# Altium schematic sheet HT66F0185_NightLED_V4.0.SchDoc
size A3
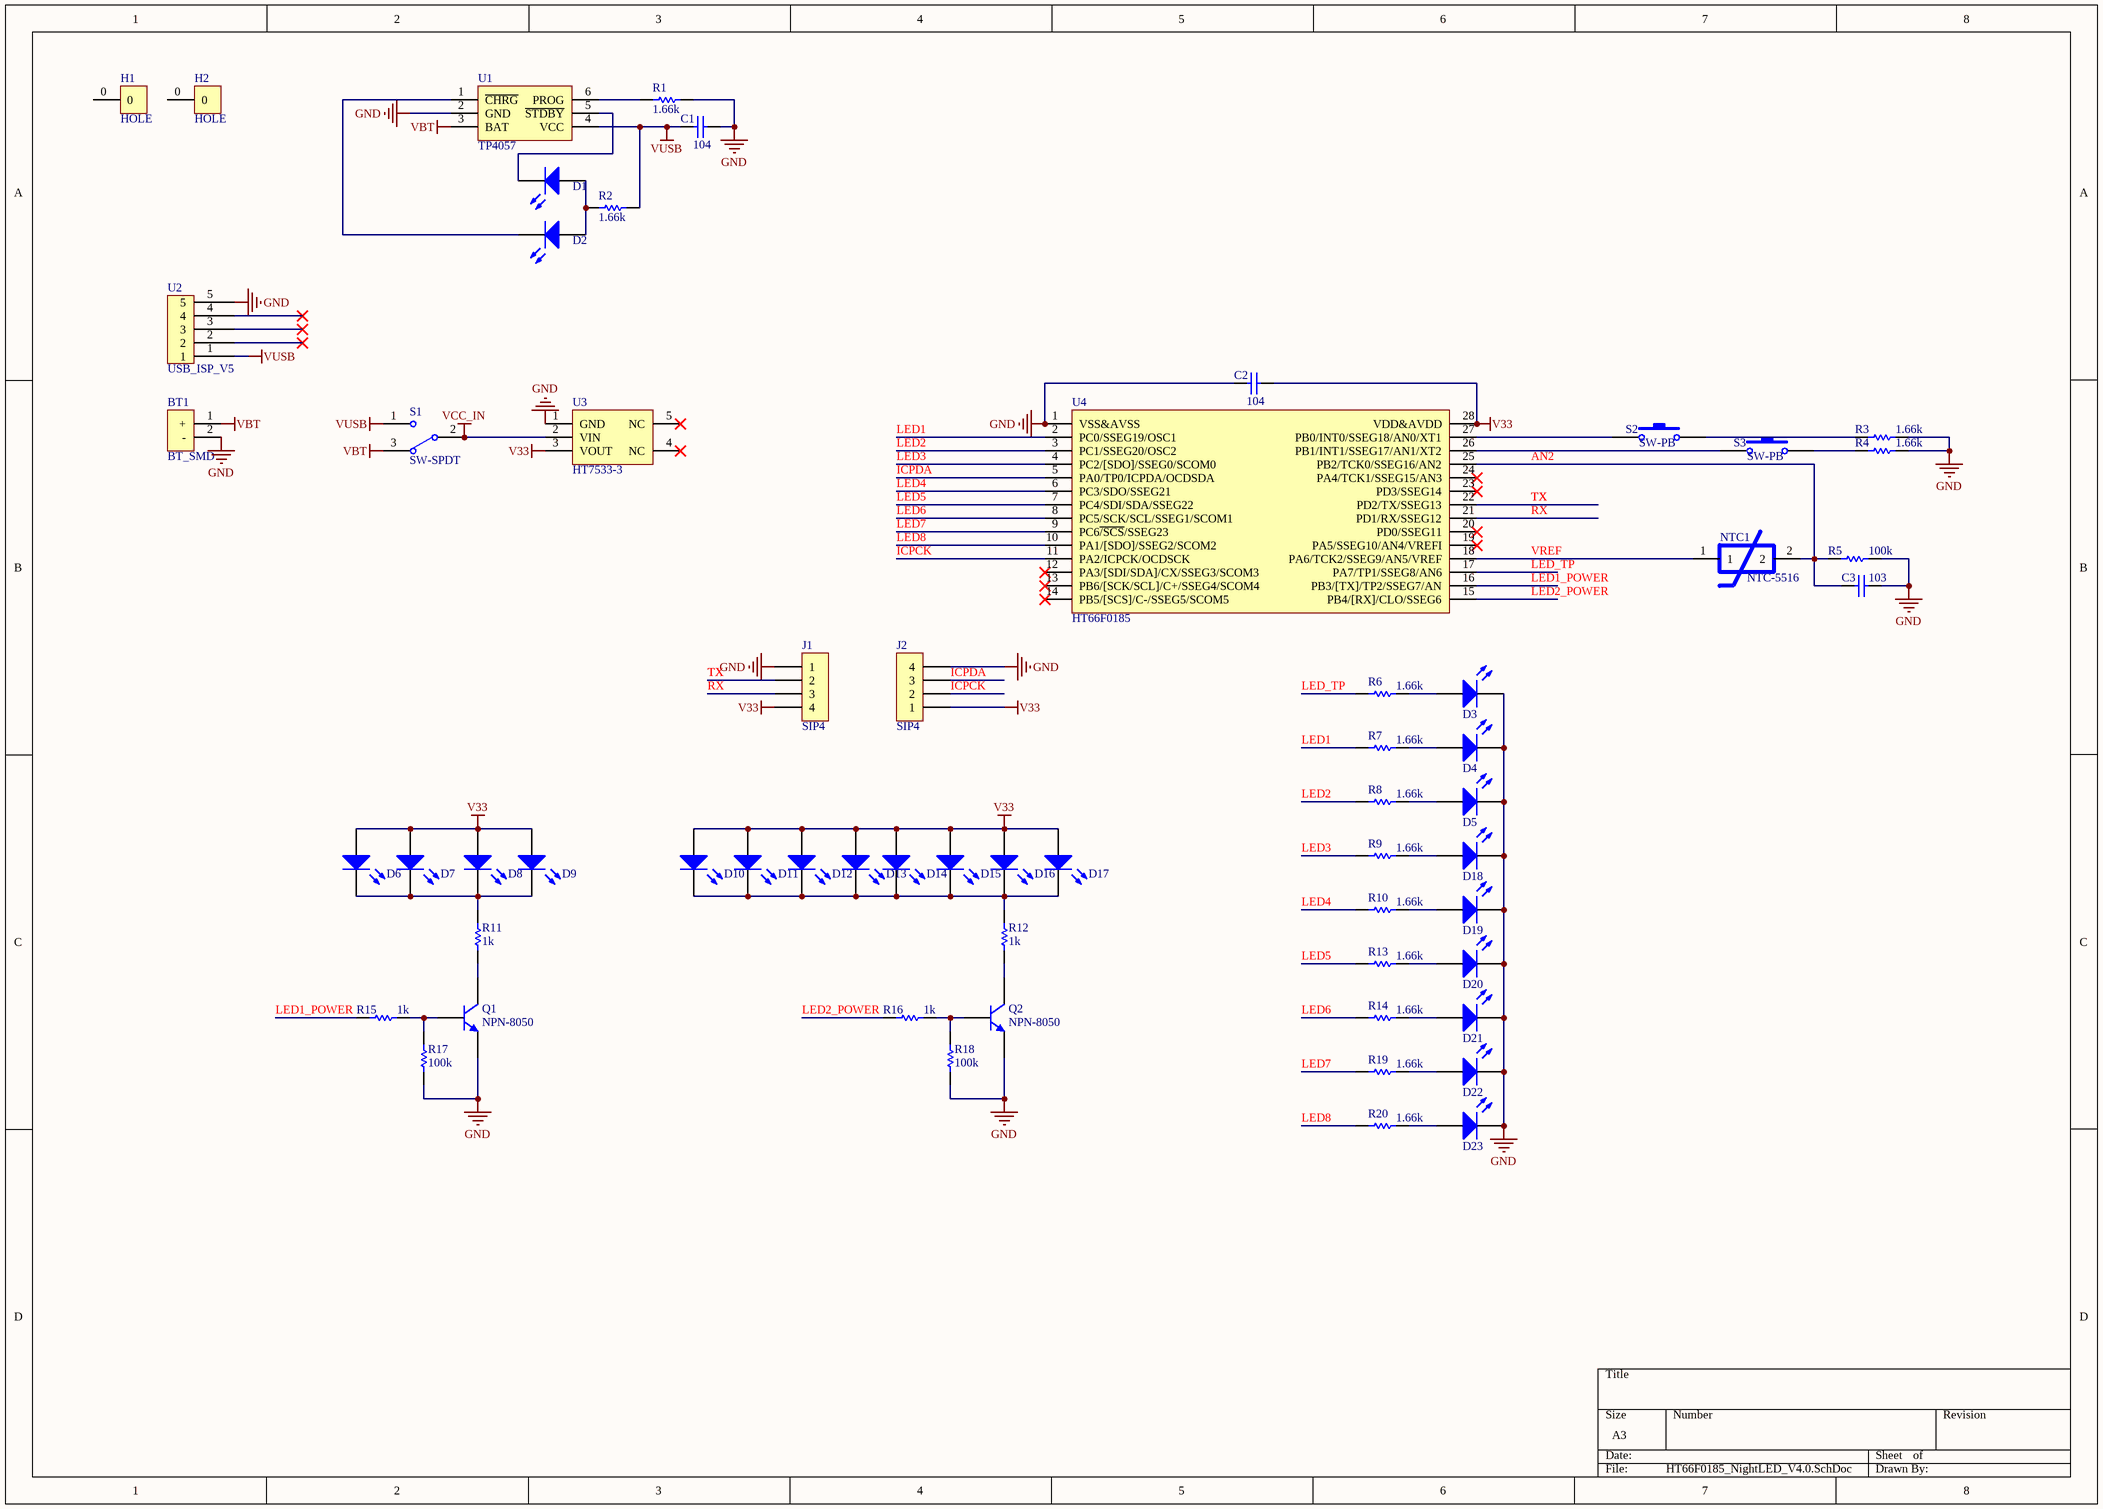
[diagram p0: HT66F0185_NightLED_V4.0.SchDoc]

## Parts
BT1  BT_SMD  [PIN_2]
C1  value 104  [C_0603]  (hidden comment: Cap)
C2  value 104  [C_0603]  (hidden comment: Cap)
C3  value 103  [C_0603]  (hidden comment: Cap)
D1  LED0  [LED_0805(Y)]  (value not drawn)
D2  LED0  [LED_0805(Y)]  (value not drawn)
D3  LED0  [LED_0805(Y)]  (value not drawn)
D4  LED0  [LED_0805(Y)]  (value not drawn)
D5  LED0  [LED_0805(Y)]  (value not drawn)
D6  LED0  [LED_0805(Y)]  (value not drawn)
D7  LED0  [LED_0805(Y)]  (value not drawn)
D8  LED0  [LED_0805(Y)]  (value not drawn)
D9  LED0  [LED_0805(Y)]  (value not drawn)
D10  LED0  [LED_0805(Y)]  (value not drawn)
D11  LED0  [LED_0805(Y)]  (value not drawn)
D12  LED0  [LED_0805(Y)]  (value not drawn)
D13  LED0  [LED_0805(Y)]  (value not drawn)
D14  LED0  [LED_0805(Y)]  (value not drawn)
D15  LED0  [LED_0805(Y)]  (value not drawn)
D16  LED0  [LED_0805(Y)]  (value not drawn)
D17  LED0  [LED_0805(Y)]  (value not drawn)
D18  LED0  [LED_0805(Y)]  (value not drawn)
D19  LED0  [LED_0805(Y)]  (value not drawn)
D20  LED0  [LED_0805(Y)]  (value not drawn)
D21  LED0  [LED_0805(Y)]  (value not drawn)
D22  LED0  [LED_0805(Y)]  (value not drawn)
D23  LED0  [LED_0805(Y)]  (value not drawn)
H1  HOLE  [Screw Hole_NightLED_V4.0]
H2  HOLE  [Screw Hole_NightLED_V4.0]
J1  SIP4  [PIN_4(SMD) - duplicate]
J2  SIP4  [PIN_4(SMD) - duplicate]
NTC1  NTC-5516  [PIN_2]
Q1  NPN-8050  [SOT_23_3]
Q2  NPN-8050  [SOT_23_3]
R1  value 1.66k  [R_0603]  (hidden comment: Res1)
R2  value 1.66k  [R_0603]  (hidden comment: Res1)
R3  value 1.66k  [R_0603]  (hidden comment: Res1)
R4  value 1.66k  [R_0603]  (hidden comment: Res1)
R5  value 100k  [R_0603]  (hidden comment: Res1)
R6  value 1.66k  [R_0603]  (hidden comment: Res1)
R7  value 1.66k  [R_0603]  (hidden comment: Res1)
R8  value 1.66k  [R_0603]  (hidden comment: Res1)
R9  value 1.66k  [R_0603]  (hidden comment: Res1)
R10  value 1.66k  [R_0603]  (hidden comment: Res1)
R11  value 1k  [R_0603]  (hidden comment: Res1)
R12  value 1k  [R_0603]  (hidden comment: Res1)
R13  value 1.66k  [R_0603]  (hidden comment: Res1)
R14  value 1.66k  [R_0603]  (hidden comment: Res1)
R15  value 1k  [R_0603]  (hidden comment: Res1)
R16  value 1k  [R_0603]  (hidden comment: Res1)
R17  value 100k  [R_0603]  (hidden comment: Res1)
R18  value 100k  [R_0603]  (hidden comment: Res1)
R19  value 1.66k  [R_0603]  (hidden comment: Res1)
R20  value 1.66k  [R_0603]  (hidden comment: Res1)
S1  SW-SPDT  [SW-SPDT]
S2  SW-PB  [micro button_4_SMD]
S3  SW-PB  [micro button_2_SMD]
U1  TP4057  [SOT_23_6]
U2  USB_ISP_V5  [MicroUSB]
U3  HT7533-3  [SOT_23_5]
U4  HT66F0185  [SSOP_28]

## Nets
GND: BT1.2(-) C1.1 C2.2 C3.1 D3.2(K) D4.2(K) D5.2(K) D18.2(K) D19.2(K) D20.2(K) D21.2(K) D22.2(K) D23.2(K) J1.1 J2.4 Q1.3(E) Q2.3(E) R1.1 R3.1 R4.1 R5.1 R17.2 R18.2 U1.2(GND) U2.5 U3.1(GND) U4.1(VSS&AVSS)
V33: C2.1 D6.1(A) D7.1(A) D8.1(A) D9.1(A) D10.1(A) D11.1(A) D12.1(A) D13.1(A) D14.1(A) D15.1(A) D16.1(A) D17.1(A) J1.4 J2.1 U3.3(VOUT) U4.28(VDD&AVDD)
VBT: BT1.1(+) S1.3 U1.3(BAT)
VCC_IN: S1.2 U3.2(VIN)
VUSB: C1.2 R2.1 S1.1 U1.4(VCC) U2.1
AN2: C3.2 NTC1.2 R5.2 U4.25(PB2/TCK0/SSEG16/AN2)
ICPCK: J2.2 U4.11(PA2/ICPCK/OCDSCK)
ICPDA: J2.3 U4.5(PA0/TP0/ICPDA/OCDSDA)
LED1: R7.2 U4.2(PC0/SSEG19/OSC1)
LED1_POWER: R15.2 U4.16(PB3/[TX]/TP2/SSEG7/AN)
LED2: R8.2 U4.3(PC1/SSEG20/OSC2)
LED2_POWER: R16.2 U4.15(PB4/[RX]/CLO/SSEG6)
LED3: R9.2 U4.4(PC2/[SDO]/SSEG0/SCOM0)
LED4: R10.2 U4.6(PC3/SDO/SSEG21)
LED5: R13.2 U4.7(PC4/SDI/SDA/SSEG22)
LED6: R14.2 U4.8(PC5/SCK/SCL/SSEG1/SCOM1)
LED7: R19.2 U4.9(PC6~{/SCS}/SSEG23)
LED8: R20.2 U4.10(PA1/[SDO]/SSEG2/SCOM2)
LED_TP: R6.2 U4.17(PA7/TP1/SSEG8/AN6)
RX: J1.3 U4.21(PD1/RX/SSEG12)
TX: J1.2 U4.22(PD2/TX/SSEG13)
VREF: NTC1.1 U4.18(PA6/TCK2/SSEG9/AN5/VREF)
NetD1_1: D1.1(A) D2.1(A) R2.2
NetD1_2: D1.2(K) U1.5(~{STDBY})
NetD2_2: D2.2(K) U1.1(~{CHRG})
NetD3_1: D3.1(A) R6.1
NetD4_1: D4.1(A) R7.1
NetD5_1: D5.1(A) R8.1
NetD6_2: D6.2(K) D7.2(K) D8.2(K) D9.2(K) R11.1
NetD10_2: D10.2(K) D11.2(K) D12.2(K) D13.2(K) D14.2(K) D15.2(K) D16.2(K) D17.2(K) R12.1
NetD18_1: D18.1(A) R9.1
NetD19_1: D19.1(A) R10.1
NetD20_1: D20.1(A) R13.1
NetD21_1: D21.1(A) R14.1
NetD22_1: D22.1(A) R19.1
NetD23_1: D23.1(A) R20.1
NetQ1_1: Q1.1(C) R11.2
NetQ1_2: Q1.2(B) R15.1 R17.1
NetQ2_1: Q2.1(C) R12.2
NetQ2_2: Q2.2(B) R16.1 R18.1
NetR1_2: R1.2 U1.6(PROG)
NetR3_2: R3.2 S2.2
NetR4_2: R4.2 S3.2
NetS2_1: S2.1 U4.27(PB0/INT0/SSEG18/AN0/XT1)
NetS3_1: S3.1 U4.26(PB1/INT1/SSEG17/AN1/XT2)

Not connected (* = marked no-connect by the designer): H1 0; H2 0; U2 2* 3* 4*; U3 4(NC)* 5(NC)*; U4 12(PA3/[SDI/SDA]/CX/SSEG3/SCOM3)* 13(PB6/[SCK/SCL]/C+/SSEG4/SCOM4)* 14(PB5/[SCS]/C-/SSEG5/SCOM5)* 19(PA5/SSEG10/AN4/VREFI)* 20(PD0/SSEG11)* 23(PD3/SSEG14)* 24(PA4/TCK1/SSEG15/AN3)*

## Library data of the parts
C1-C3 = Cap: Capacitor; Published: 8-Jun-2000; LatestRevisionDate: 17-Jul-2002; LatestRevisionNote: Re-released for DXP Platform.; PackageReference: RAD-0.3; Publisher: Altium Limited; PackageDescription: Radial Cap, Thru-Hole; 2 Leads; 0.3 in Pin Spacing
D1-D23 = LED0: Typical INFRARED GaAs LED; Published: 8-Jun-2000; LatestRevisionDate: 08-Jul-2005; LatestRevisionNote: Mech Layer 1 removed.; PackageReference: LED-0; Publisher: Altium Limited; PackageDescription: LED; 2 Leads
J1 J2 = SIP4: jointbar
NTC1 = NTC
Q1 Q2 = NPN: NPN Bipolar Transistor; Published: 8-Jun-2000; LatestRevisionDate: 17-Jul-2002; LatestRevisionNote: Re-released for DXP Platform.; PackageReference: TO-226-AA; Publisher: Altium Limited; PackageDescription: TO, Flat Index; 3 In-Line, Axial Leads; Body Dia. 4.8mm; Leads 0.55 x 0.51 mm (max); Code_JEDEC: TO-226-AA
R1-R20 = Res1: Resistor; Published: 8-Jun-2000; LatestRevisionDate: 17-Jul-2002; LatestRevisionNote: Re-released for DXP Platform.; PackageReference: AXIAL-0.3; Publisher: Altium Limited; PackageDescription: Axial Device, Thru-Hole; 2 Leads; 0.3 in Pin Spacing
S1 = SW-SPDT: SPDT Subminiature Toggle Switch, Right Angle Mounting, Vertical Actuation; Published: 24-Mar-1999; LatestRevisionDate: 17-Dec-2003; LatestRevisionNote: Schematic revised, PCB Footprint replaced.; DatasheetVersion: 05-Dec-2000; PackageReference: TL36WW15050; Publisher: Altium Limited; PackageDescription: Switch; 4 Leads; ComponentLink1Description: Manufacturer Link; ComponentLink1URL: http://www.apem.com
S2 S3 = SW-PB: Switch; Published: 24-Mar-1999; LatestRevisionDate: 17-Jul-2002; LatestRevisionNote: Re-released for DXP Platform.; PackageReference: SPST-2; Publisher: Altium Limited; PackageDescription: Switch; 2 Leads
U2 = JP5: USB